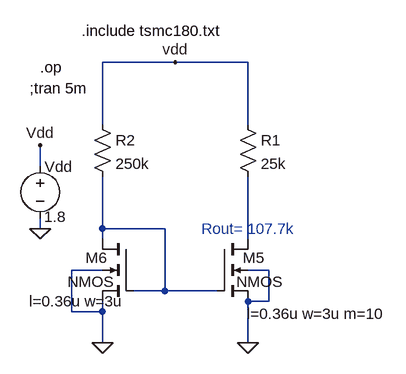
[diagram p0: schematic current mirror.asc]
current mirror.asc, the LTspice schematic file:
Version 4
SHEET 1 1304 692
WIRE 464 176 352 176
WIRE 576 176 464 176
WIRE 352 272 352 176
WIRE 576 272 576 176
WIRE 256 336 256 304
WIRE 256 432 256 416
WIRE 352 432 352 352
WIRE 448 432 352 432
WIRE 352 448 352 432
WIRE 576 448 576 352
WIRE 352 496 304 496
WIRE 608 496 576 496
WIRE 448 528 448 432
WIRE 448 528 400 528
WIRE 528 528 448 528
WIRE 608 544 608 496
WIRE 608 544 576 544
WIRE 304 560 304 496
WIRE 352 560 352 544
WIRE 352 560 304 560
WIRE 352 608 352 560
WIRE 576 608 576 544
FLAG 256 304 Vdd
FLAG 464 176 vdd
FLAG 352 608 0
FLAG 576 608 0
FLAG 256 432 0
SYMBOL voltage 256 320 R0
WINDOW 123 0 0 Left 0
WINDOW 39 0 0 Left 0
WINDOW 0 7 17 Left 2
WINDOW 3 6 94 Left 2
SYMATTR InstName Vdd
SYMATTR Value 1.8
SYMBOL nmos4 528 448 R0
WINDOW 0 40 29 Left 2
WINDOW 3 30 66 Left 2
WINDOW 123 260 115 Right 2
SYMATTR InstName M5
SYMATTR Value2 l=0.36u w=3u m=10
SYMBOL nmos4 400 448 M0
WINDOW 0 40 29 Left 2
WINDOW 3 30 66 Left 2
WINDOW 123 161 96 Right 2
SYMATTR InstName M6
SYMATTR Value2 l=0.36u w=3u
SYMBOL res 560 256 R0
SYMATTR InstName R1
SYMATTR Value 25k
SYMBOL res 336 256 R0
SYMATTR InstName R2
SYMATTR Value 250k
TEXT 320 128 Left 2 !.include tsmc180.txt
TEXT 256 184 Left 2 !.op
TEXT 240 216 Left 2 !;tran 5m
TEXT 504 432 Left 2 ;Rout= 107.7k

The netlist it stands for:
* current mirror.asc
Vdd Vdd 0 1.8
M5 N002 N001 0 0 NMOS l=0.36u w=3u m=10
M6 N001 N001 0 0 NMOS l=0.36u w=3u
R1 Vdd N002 25k
R2 Vdd N001 250k
.model NMOS NMOS
.model PMOS PMOS
.lib standard.mos
.include tsmc180.txt
.op
;tran 5m
* Rout= 107.7k
.backanno
.end